# Altium schematic sheet Stepper_Motor_IC_Circuit.SchDoc
size A4; DocumentNumber: 3; SheetNumber: 3
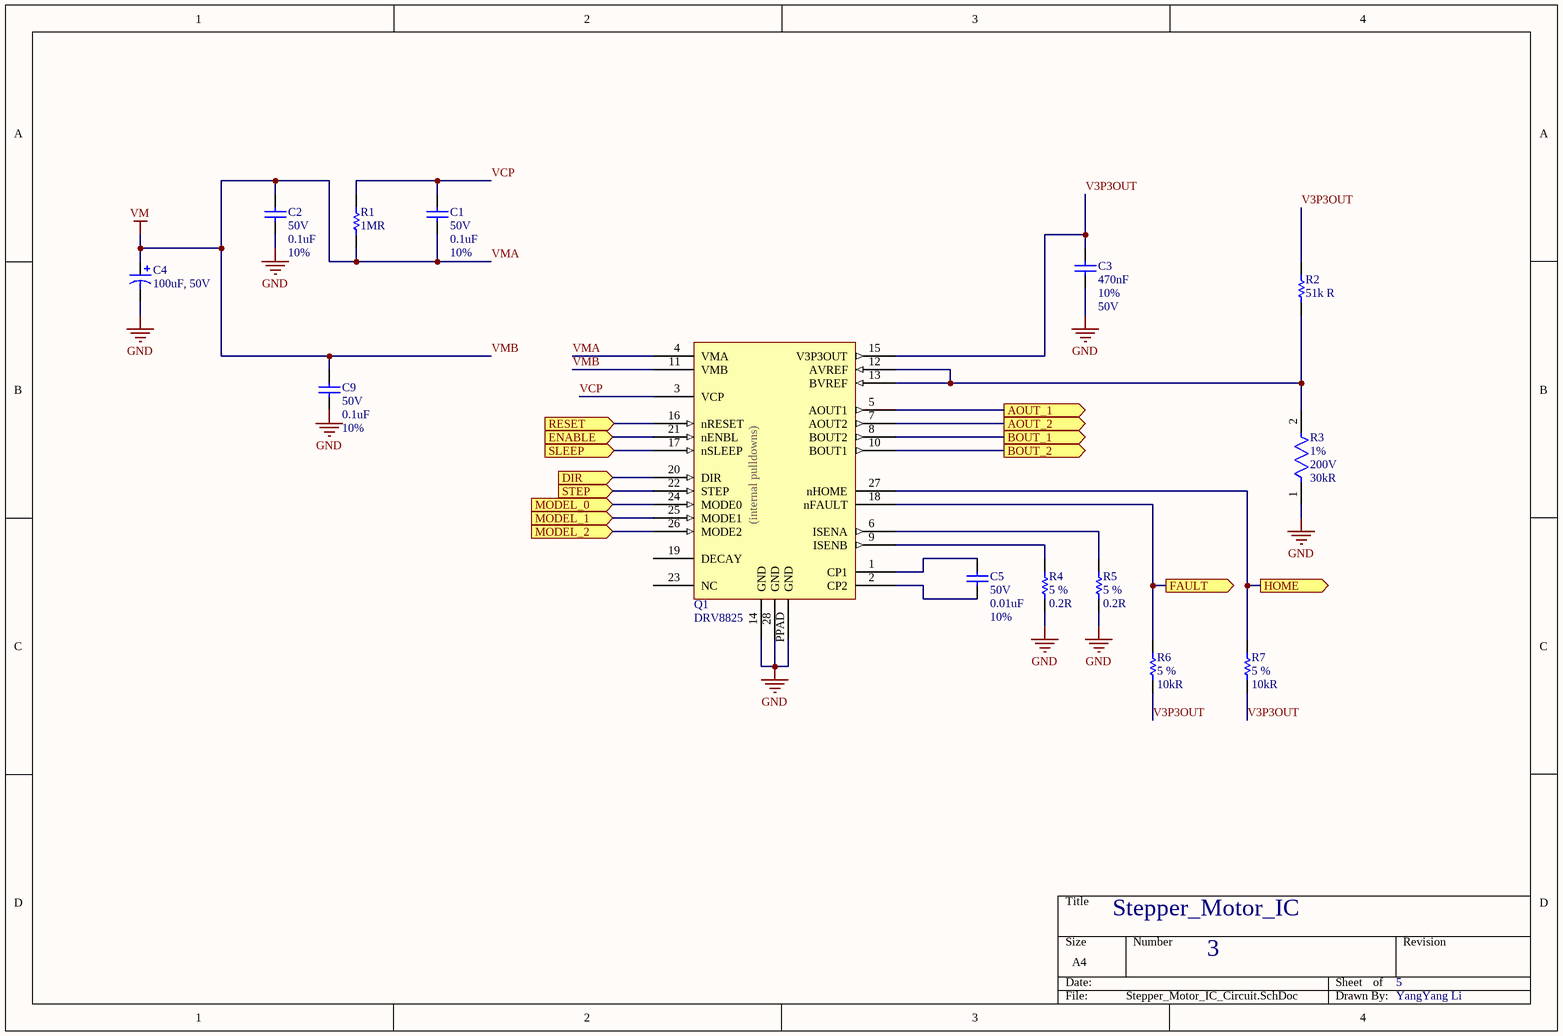
[diagram p0: Stepper_Motor_IC_Circuit.SchDoc]

## Parts
C1  Voltage Rating: 50V  Capacitance: 0.1uF  Tolerance: 10%  [KEMT-1206-2_L]  (hidden comment: C1206C103K5RACTU)
C2  Voltage Rating: 50V  Capacitance: 0.1uF  Tolerance: 10%  [KEMT-1206-2_L]  (hidden comment: C1206C103K5RACTU)
C3  Capacitance - nF: 470nF  Tolerance: 10%  Voltage Rating: 50V  [CAPC3216X100X50NL20T25]  (hidden comment: 1206C474K5RACTU)
C4  100uF, 50V  [Capacitor radial 8mm]
C5  Voltage Rating: 50V  Capacitance: 0.01uF  Tolerance: 10%  [KEMT-1206-2_L]  (hidden comment: C1206C103K5RACTU)
C9  Voltage Rating: 50V  Capacitance: 0.1uF  Tolerance: 10%  [KEMT-1206-2_L]  (hidden comment: C1206C103K5RACTU)
Q1  DRV8825  [DRV8825 HTSSOP]
R1  Resistance: 1MR  [RESC3216X70X50NL05T20]  (hidden comment: ERJ-8ENF1004V)
R2  51k R  [RESC3216X60X45NL10T20]
R3  Tolerance: 1%  Voltage Rating: 200V  Resistance: 30kR  [FP-CR1206-MFG]  (hidden comment: CR1206-FX-3002ELF)
R4  value 0.2R  Tolerance: 5 %  [RESC1206(3216)_L]  (hidden comment: 0.2R 5% 1206(3216))
R5  value 0.2R  Tolerance: 5 %  [RESC1206(3216)_L]  (hidden comment: 0.2R 5% 1206(3216))
R6  value 10kR  Tolerance: 5 %  [RESC1206(3216)_M]  (hidden comment: 10K 5% 1206(3216))
R7  value 10kR  Tolerance: 5 %  [RESC1206(3216)_M]  (hidden comment: 10K 5% 1206(3216))

## Ports
AOUT_1 (out), AOUT_2 (out), BOUT_1 (out), BOUT_2 (out), DIR (in), ENABLE (in), FAULT (out), HOME (out), MODEL_0 (in), MODEL_1 (in), MODEL_2 (in), RESET (in), SLEEP (in), STEP (in)

## Nets
GND: C2.2 C3.2 C4.2 C9.2 Q1.14(GND) Q1.28(GND) Q1.PPAD(GND) R3.1 R4.2 R5.2
VMA: C1.2 C2.1 C4.1 C9.1 Q1.4(VMA) Q1.11(VMB) R1.2  [also labelled VM, VMB]
AOUT_1: Q1.5(AOUT1) ; port AOUT_1
AOUT_2: Q1.7(AOUT2) ; port AOUT_2
BOUT_1: Q1.8(BOUT2) ; port BOUT_1
BOUT_2: Q1.10(BOUT1) ; port BOUT_2
DIR: Q1.20(DIR) ; port DIR
ENABLE: Q1.21(nENBL) ; port ENABLE
FAULT: Q1.18(nFAULT) R6.2 ; port FAULT
HOME: Q1.27(nHOME) R7.2 ; port HOME
MODEL_0: Q1.24(MODE0) ; port MODEL_0
MODEL_1: Q1.25(MODE1) ; port MODEL_1
MODEL_2: Q1.26(MODE2) ; port MODEL_2
RESET: Q1.16(nRESET) ; port RESET
SLEEP: Q1.17(nSLEEP) ; port SLEEP
STEP: Q1.22(STEP) ; port STEP
V3P3OUT: C3.1 Q1.15(V3P3OUT) R2.2 R6.1 R7.1
VCP: C1.1 Q1.3(VCP) R1.1
NetC5_1: C5.1 Q1.2(CP2)
NetC5_2: C5.2 Q1.1(CP1)
NetQ1_6: Q1.6(ISENA) R5.1
NetQ1_9: Q1.9(ISENB) R4.1
NetQ1_12: Q1.12(AVREF) Q1.13(BVREF) R2.1 R3.2

Not connected (* = marked no-connect by the designer): Q1 19(DECAY) 23(NC)

## Notes on the sheet
- Stepper_Motor_IC
- 3
- 5
- YangYang Li
- (in symbol Stepper motor driver DRV8824) (internal pulldowns)

## Library data of the parts
C1 C2 C5 C9 = CMP-2000-06008-1: Surface Mount Multilayer Ceramic Chip Capacitor, X7R Dielectric, 50 V, -55 to 125 degC, 2-Pin SMD (1206), RoHS, Tape and Reel; Manufacturer: Kemet; Brand/Series: CSeries; Mounting Technology: SurfaceMount; Material, Element: Ceramic; Termination: SMD; Temperature Coefficient: X7R; Package Reference: 1206-2; Dimensions: 0.126"x0.063"(3.2x1.6mm)LxW; Package Description: 2-Leads SMD, Body 3.2 x 1.6 mm; Datasheet Version: 07/2013; Manufacturer URL: http://www.kemet.com/; Mounting Type: PCB; Case Size: 1206(3216mm); Datasheet URL: https://datasheet.ciiva.com/7729/1725435-7729792.pdf
C3 = CMP-2000-06016-1: Chip Capacitor, 470 nF, +/- 10%, 50 V, -55 to 125 degC, 1206 (3216 Metric), RoHS, Tape and Reel; Manufacturer: Kemet; Case Length: 3.2mm; Class: 2; Case Height: 0.9mm; Capacitance - pF: 470000pF; Dielectric: X7R; Case Width: 1.6mm; Temperature Coefficient / Code: +/-15%; Type: SMDMLCCsX7R,Commercial; Manufacturer URL: http://www.kemet.com/; Maximum Operating Temperature: +125C; Minimum Operating Temperature: -55C; Brand: Kemet; Case Code - in: 1206; Datasheet Version: 02/2016; Case Code - mm: 3216; Series: C1206C; Mounting Technology: SurfaceMount; Package Reference: 1206; Termination Style: SMD/SMT; Datasheet URL: http://www.kemet.com/docfinder?Partnumber=C1206C106K8RACTU; Dimensions: 1.6mmWx3.2mmLx0.9mmH; Packaging: Reel; Factory Pack Quantity: 4000; Product Category: MultilayerCeramicCapacitorsMLCC-SMD/SMT; RoHS: Details; Operating Temperature Range: -55Cto+125C; Product: GeneralTypeMLCCs; Voltage Rating DC: 50V; Package Description: 2-Pin Surface Mount Device, Body 3.2 x 1.6 mm; Package / Case: 1206(3216metric)
C4 = Cap 100uF, 50V, THT radial: Electrolytic Capacitor, 100 µF, 50 V, ± 20%, Radial Leaded, 8 mm
Q1 = Stepper motor driver DRV8824: TI DRV8825 Stepper Motor Controller IC
R1 = CMP-2003-00020-1: Manufacturer: Panasonic; Part Number: ERJ-8ENF1004V
R2 = CMP-2003-02261-1: CRCW120651K0JNEA; Manufacturer: Vishay Dale; Part Number: CRCW120651K0JNEA
R3 = CMP-07231-000998-1: Thick Film Chip Resistors 1206 30kΩ 0.25W 1% 100ppm/°C; Max Power Dissipation: 250mW; Max Operating Temperature: 155°C; Width: 1.6mm; Contact Plating: Tin; Thickness: 610um; Mount: Surface Mount; Case/Package: 1206; Package Quantity: 5000; Radiation Hardening: No; Case Code (Metric): 3216; Termination: SMD/SMT; Temperature Coefficient: 100ppm/°C; Power Rating: 250mW; Min Operating Temperature: -55°C; Number of Terminations: 2; Composition: Thick Film; Height: 0.03inch; Length: 3.2mm; Packaging: Tape and Reel; Depth: 1.6mm; Case Code (Imperial): 1206; Military Standard: Not
R4 R5 = CMP-1014-00057-1: 0.2R 0.25W 5% 1206 (3216 Metric)  SMD; Case-EIA: 1206; Case-Metric: 3216; Technology: SMT; Power: 0.25 W
R6 R7 = CMP-1014-00098-1: 10K 0.25W 5% 1206 (3216 Metric)  SMD; Case-Metric: 3216; Case-EIA: 1206; Power: 0.25 W; Technology: SMT